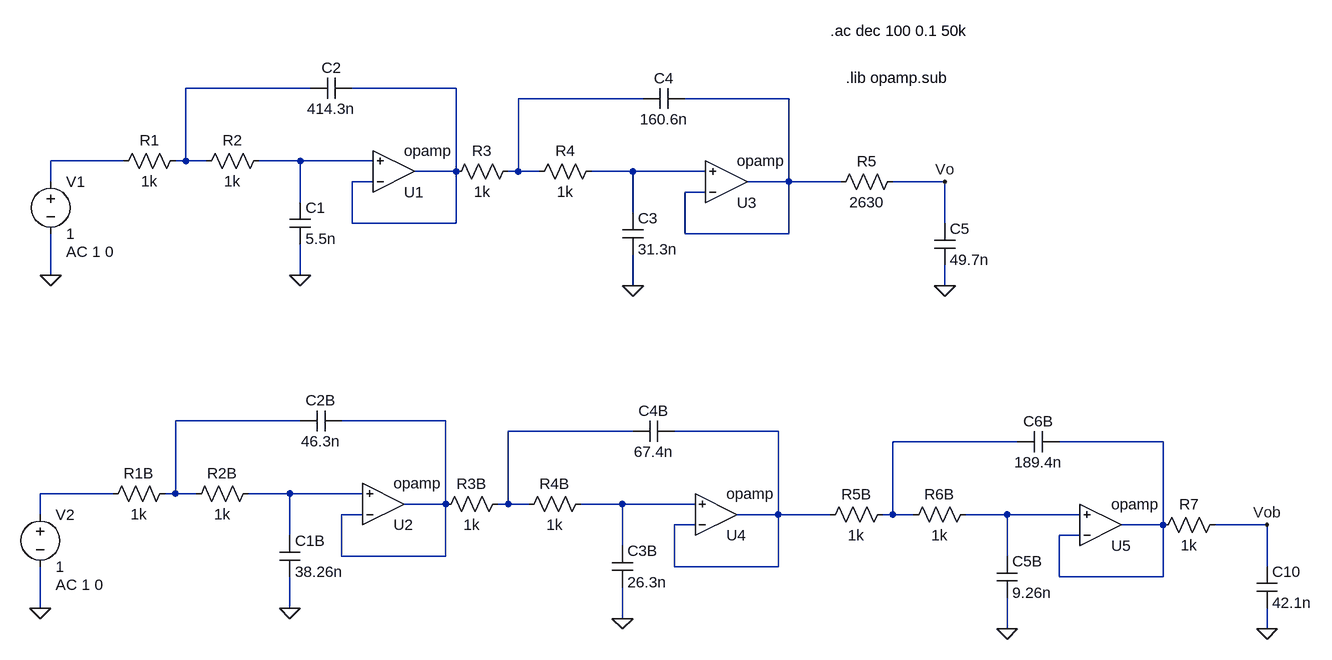
[diagram p0: schematic Ex4_SallenKey.asc]
Ex4_SallenKey.asc, the LTspice schematic file:
Version 4
SHEET 1 1596 1220
WIRE 48 -32 -144 -32
WIRE 272 -32 112 -32
WIRE 560 -16 368 -16
WIRE 784 -16 624 -16
WIRE -240 80 -352 80
WIRE -144 80 -144 -32
WIRE -144 80 -160 80
WIRE -112 80 -144 80
WIRE 32 80 -32 80
WIRE 144 80 32 80
WIRE 272 96 272 -32
WIRE 272 96 208 96
WIRE 368 96 368 -16
WIRE 368 96 352 96
WIRE 400 96 368 96
WIRE 544 96 480 96
WIRE 656 96 544 96
WIRE -352 112 -352 80
WIRE 144 112 112 112
WIRE 784 112 784 -16
WIRE 784 112 720 112
WIRE 864 112 784 112
WIRE 1024 112 944 112
WIRE 656 128 624 128
WIRE 32 144 32 80
WIRE 544 160 544 96
WIRE 112 176 112 112
WIRE 272 176 272 96
WIRE 272 176 112 176
WIRE 1024 176 1024 112
WIRE 624 192 624 128
WIRE 784 192 784 112
WIRE 784 192 624 192
WIRE -352 256 -352 192
WIRE 32 256 32 208
WIRE 544 272 544 224
WIRE 1024 272 1024 240
WIRE 32 480 -160 480
WIRE 256 480 96 480
WIRE 544 496 352 496
WIRE 768 496 608 496
WIRE 1136 512 944 512
WIRE 1360 512 1200 512
WIRE -256 592 -368 592
WIRE -160 592 -160 480
WIRE -160 592 -176 592
WIRE -128 592 -160 592
WIRE 16 592 -48 592
WIRE 128 592 16 592
WIRE 256 608 256 480
WIRE 256 608 192 608
WIRE 352 608 352 496
WIRE 352 608 336 608
WIRE 384 608 352 608
WIRE 528 608 464 608
WIRE 640 608 528 608
WIRE -368 624 -368 592
WIRE 128 624 96 624
WIRE 768 624 768 496
WIRE 768 624 704 624
WIRE 848 624 768 624
WIRE 944 624 944 512
WIRE 944 624 928 624
WIRE 976 624 944 624
WIRE 1120 624 1056 624
WIRE 1232 624 1120 624
WIRE 640 640 608 640
WIRE 1360 640 1360 512
WIRE 1360 640 1296 640
WIRE 1520 640 1440 640
WIRE 16 656 16 592
WIRE 1232 656 1200 656
WIRE 528 672 528 608
WIRE 96 688 96 624
WIRE 256 688 256 608
WIRE 256 688 96 688
WIRE 1120 688 1120 624
WIRE 608 704 608 640
WIRE 768 704 768 624
WIRE 768 704 608 704
WIRE 1520 704 1520 640
WIRE 1200 720 1200 656
WIRE 1360 720 1360 640
WIRE 1360 720 1200 720
WIRE -368 768 -368 704
WIRE 16 768 16 720
WIRE 528 784 528 736
WIRE 1120 800 1120 752
WIRE 1520 800 1520 768
FLAG -352 256 0
FLAG 32 256 0
FLAG 544 272 0
FLAG 1024 272 0
FLAG 1024 112 Vo
FLAG -368 768 0
FLAG 16 768 0
FLAG 528 784 0
FLAG 1520 800 0
FLAG 1520 640 Vob
FLAG 1120 800 0
SYMBOL OpAmps\\opamp 176 160 M180
SYMATTR InstName U1
SYMBOL voltage -352 96 R0
WINDOW 123 24 124 Left 2
WINDOW 39 0 0 Left 0
SYMATTR InstName V1
SYMATTR Value 1
SYMATTR Value2 AC 1 0
SYMBOL res -144 64 R90
WINDOW 0 0 56 VBottom 2
WINDOW 3 32 56 VTop 2
SYMATTR InstName R1
SYMATTR Value 1k
SYMBOL res -16 64 R90
WINDOW 0 0 56 VBottom 2
WINDOW 3 32 56 VTop 2
SYMATTR InstName R2
SYMATTR Value 1k
SYMBOL cap 16 144 R0
SYMATTR InstName C1
SYMATTR Value 5.5n
SYMBOL cap 112 -48 R90
WINDOW 0 0 32 VBottom 2
WINDOW 3 32 32 VTop 2
SYMATTR InstName C2
SYMATTR Value 414.3n
SYMBOL OpAmps\\opamp 688 176 M180
SYMATTR InstName U3
SYMBOL res 368 80 R90
WINDOW 0 0 56 VBottom 2
WINDOW 3 32 56 VTop 2
SYMATTR InstName R3
SYMATTR Value 1k
SYMBOL res 496 80 R90
WINDOW 0 0 56 VBottom 2
WINDOW 3 32 56 VTop 2
SYMATTR InstName R4
SYMATTR Value 1k
SYMBOL cap 528 160 R0
SYMATTR InstName C3
SYMATTR Value 31.3n
SYMBOL cap 624 -32 R90
WINDOW 0 0 32 VBottom 2
WINDOW 3 32 32 VTop 2
SYMATTR InstName C4
SYMATTR Value 160.6n
SYMBOL res 960 96 R90
WINDOW 0 0 56 VBottom 2
WINDOW 3 32 56 VTop 2
SYMATTR InstName R5
SYMATTR Value 2630
SYMBOL cap 1008 176 R0
SYMATTR InstName C5
SYMATTR Value 49.7n
SYMBOL OpAmps\\opamp 160 672 M180
SYMATTR InstName U2
SYMBOL voltage -368 608 R0
WINDOW 123 24 124 Left 2
WINDOW 39 0 0 Left 0
SYMATTR InstName V2
SYMATTR Value 1
SYMATTR Value2 AC 1 0
SYMBOL res -160 576 R90
WINDOW 0 0 56 VBottom 2
WINDOW 3 32 56 VTop 2
SYMATTR InstName R1B
SYMATTR Value 1k
SYMBOL res -32 576 R90
WINDOW 0 0 56 VBottom 2
WINDOW 3 32 56 VTop 2
SYMATTR InstName R2B
SYMATTR Value 1k
SYMBOL cap 0 656 R0
SYMATTR InstName C1B
SYMATTR Value 38.26n
SYMBOL cap 96 464 R90
WINDOW 0 0 32 VBottom 2
WINDOW 3 32 32 VTop 2
SYMATTR InstName C2B
SYMATTR Value 46.3n
SYMBOL OpAmps\\opamp 672 688 M180
SYMATTR InstName U4
SYMBOL res 352 592 R90
WINDOW 0 0 56 VBottom 2
WINDOW 3 32 56 VTop 2
SYMATTR InstName R3B
SYMATTR Value 1k
SYMBOL res 480 592 R90
WINDOW 0 0 56 VBottom 2
WINDOW 3 32 56 VTop 2
SYMATTR InstName R4B
SYMATTR Value 1k
SYMBOL cap 512 672 R0
SYMATTR InstName C3B
SYMATTR Value 26.3n
SYMBOL cap 608 480 R90
WINDOW 0 0 32 VBottom 2
WINDOW 3 32 32 VTop 2
SYMATTR InstName C4B
SYMATTR Value 67.4n
SYMBOL res 1456 624 R90
WINDOW 0 0 56 VBottom 2
WINDOW 3 32 56 VTop 2
SYMATTR InstName R7
SYMATTR Value 1k
SYMBOL cap 1504 704 R0
SYMATTR InstName C10
SYMATTR Value 42.1n
SYMBOL OpAmps\\opamp 1264 704 M180
SYMATTR InstName U5
SYMBOL res 944 608 R90
WINDOW 0 0 56 VBottom 2
WINDOW 3 32 56 VTop 2
SYMATTR InstName R5B
SYMATTR Value 1k
SYMBOL res 1072 608 R90
WINDOW 0 0 56 VBottom 2
WINDOW 3 32 56 VTop 2
SYMATTR InstName R6B
SYMATTR Value 1k
SYMBOL cap 1104 688 R0
SYMATTR InstName C5B
SYMATTR Value 9.26n
SYMBOL cap 1200 496 R90
WINDOW 0 0 32 VBottom 2
WINDOW 3 32 32 VTop 2
SYMATTR InstName C6B
SYMATTR Value 189.4n
TEXT 872 -48 Left 2 !.lib opamp.sub
TEXT 848 -120 Left 2 !.ac dec 100 0.1 50k

The netlist it stands for:
* Ex4_SallenKey.asc
XU1 N002 N006 N002 opamp Aol=100K GBW=10Meg  ; pins invin noninvin out
V1 N005 0 1 AC 1 0
R1 N001 N005 1k
R2 N006 N001 1k
C1 N006 0 5.5n
C2 N002 N001 414.3n
XU3 N004 N007 N004 opamp Aol=100K GBW=10Meg  ; pins invin noninvin out
R3 N003 N002 1k
R4 N007 N003 1k
C3 N007 0 31.3n
C4 N004 N003 160.6n
R5 Vo N004 2630
C5 Vo 0 49.7n
XU2 N009 N015 N009 opamp Aol=100K GBW=10Meg  ; pins invin noninvin out
V2 N014 0 1 AC 1 0
R1B N008 N014 1k
R2B N015 N008 1k
C1B N015 0 38.26n
C2B N009 N008 46.3n
XU4 N011 N016 N011 opamp Aol=100K GBW=10Meg  ; pins invin noninvin out
R3B N010 N009 1k
R4B N016 N010 1k
C3B N016 0 26.3n
C4B N011 N010 67.4n
R7 Vob N013 1k
C10 Vob 0 42.1n
XU5 N013 N017 N013 opamp Aol=100K GBW=10Meg  ; pins invin noninvin out
R5B N012 N011 1k
R6B N017 N012 1k
C5B N017 0 9.26n
C6B N013 N012 189.4n
.lib opamp.sub
.ac dec 100 0.1 50k
.backanno
.end